# Altium schematic sheet Sheet1.SchDoc
size A4; Organization: Altium Limited; Address1: L3, 12a Rodborough Rd; Address2: Frenchs Forest; Address3: NSW; Address4: Australia 2086
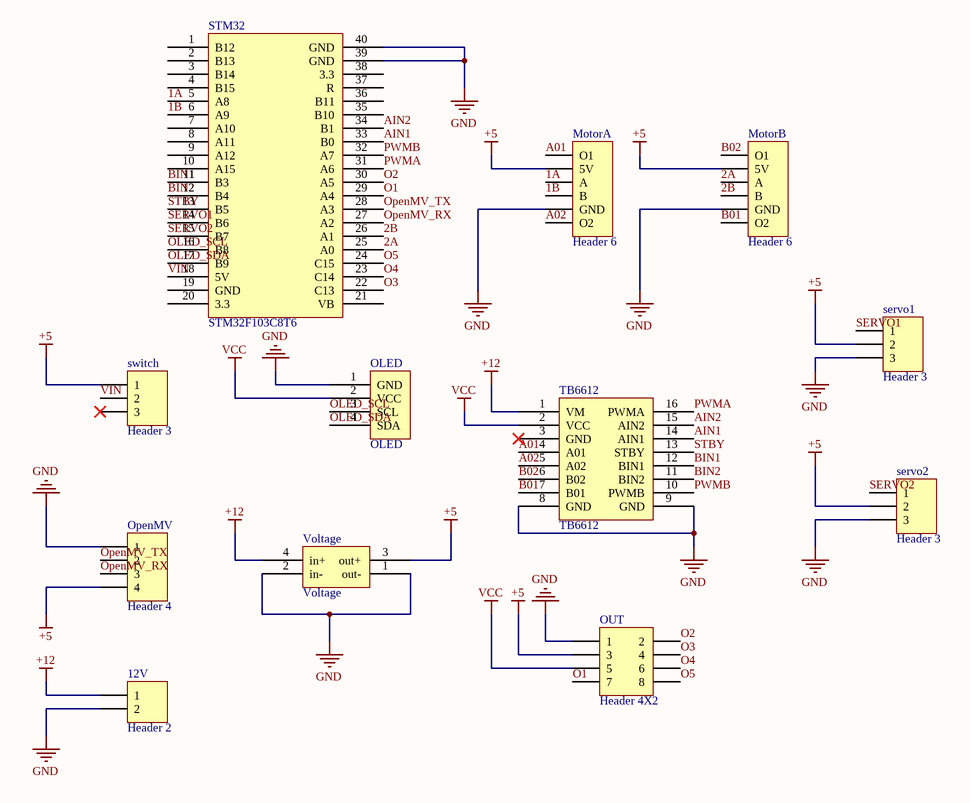
[diagram p0: Sheet1.SchDoc]

## Parts
12V  Header 2  [HDR1X2]
MotorA  Header 6  [HDR1X6]
MotorB  Header 6  [HDR1X6]
OLED  OLED  [OLED]
OpenMV  Header 4  [HDR1X4]
OUT  Header 4X2  [HDR2X4]
servo1  Header 3  [HDR1X3]
servo2  Header 3  [HDR1X3]
STM32  STM32F103C8T6  [STM32F103C8T6]
switch  Header 3  [HDR1X3]
TB6612  TB6612  [TB6612]
Voltage  Voltage  [Voltage]

## Nets
+5: MotorA.2(5V) MotorB.2(5V) OpenMV.4 OUT.3 servo1.2 servo2.2 switch.1 Voltage.3(out+)
+12: 12V.1 TB6612.1(VM) Voltage.4(in+)
GND: 12V.2 MotorA.5(GND) MotorB.5(GND) OLED.1(GND) OpenMV.1 OUT.1 servo1.3 servo2.3 STM32.39(GND) STM32.40(GND) TB6612.8(GND) TB6612.9(GND) Voltage.1(out-) Voltage.2(in-)
VCC: OLED.2(VCC) OUT.5 TB6612.2(VCC)
1A: MotorA.3(A) STM32.5(A8)
1B: MotorA.4(B) STM32.6(A9)
2A: MotorB.3(A) STM32.25(A0)
2B: MotorB.4(B) STM32.26(A1)
A01: MotorA.1(O1) TB6612.4(A01)
A02: MotorA.6(O2) TB6612.5(A02)
AIN1: STM32.33(B0) TB6612.14(AIN1)
AIN2: STM32.34(B1) TB6612.15(AIN2)
B01: MotorB.6(O2) TB6612.7(B01)
B02: MotorB.1(O1) TB6612.6(B02)
BIN1: STM32.11(B3) TB6612.12(BIN1)
BIN2: STM32.12(B4) TB6612.11(BIN2)
O1: OUT.7 STM32.29(A4)
O2: OUT.2 STM32.30(A5)
O3: OUT.4 STM32.22(C13)
O4: OUT.6 STM32.23(C14)
O5: OUT.8 STM32.24(C15)
OLED_SCL: OLED.3(SCL) STM32.16(B8)
OLED_SDA: OLED.4(SDA) STM32.17(B9)
OpenMV_RX: OpenMV.3 STM32.27(A2)
OpenMV_TX: OpenMV.2 STM32.28(A3)
PWMA: STM32.31(A6) TB6612.16(PWMA)
PWMB: STM32.32(A7) TB6612.10(PWMB)
SERVO1: servo1.1 STM32.14(B6)
SERVO2: servo2.1 STM32.15(B7)
STBY: STM32.13(B5) TB6612.13(STBY)
VIN: STM32.18(5V) switch.2

Not connected (* = marked no-connect by the designer): STM32 1(B12) 2(B13) 3(B14) 4(B15) 7(A10) 8(A11) 9(A12) 10(A15) 19(GND) 20(3.3) 21(VB) 35(B10) 36(B11) 37(R) 38(3.3); switch 3*; TB6612 3(GND)*

## Notes on the sheet
- Title
- Size:
- Date:
- A4
- Number:
- Time:
- Revision:
- Sheet
- of
- File:

## Library data of the parts
12V = Header 2: Header, 2-Pin; LatestRevisionDate: 17-Jul-2002; LatestRevisionNote: Re-released for DXP Platform.; Publisher: Altium Limited
MotorA MotorB = Encoder: Header, 6-Pin; LatestRevisionDate: 17-Jul-2002; LatestRevisionNote: Re-released for DXP Platform.; Publisher: Altium Limited
OpenMV = Header 4: Header, 4-Pin; LatestRevisionDate: 17-Jul-2002; LatestRevisionNote: Re-released for DXP Platform.; Publisher: Altium Limited
OUT = Header 4X2: Header, 4-Pin, Dual row; LatestRevisionDate: 17-Jul-2002; LatestRevisionNote: Re-released for DXP Platform.; Publisher: Altium Limited
servo1 servo2 switch = Header 3: Header, 3-Pin; LatestRevisionDate: 17-Jul-2002; LatestRevisionNote: Re-released for DXP Platform.; Publisher: Altium Limited